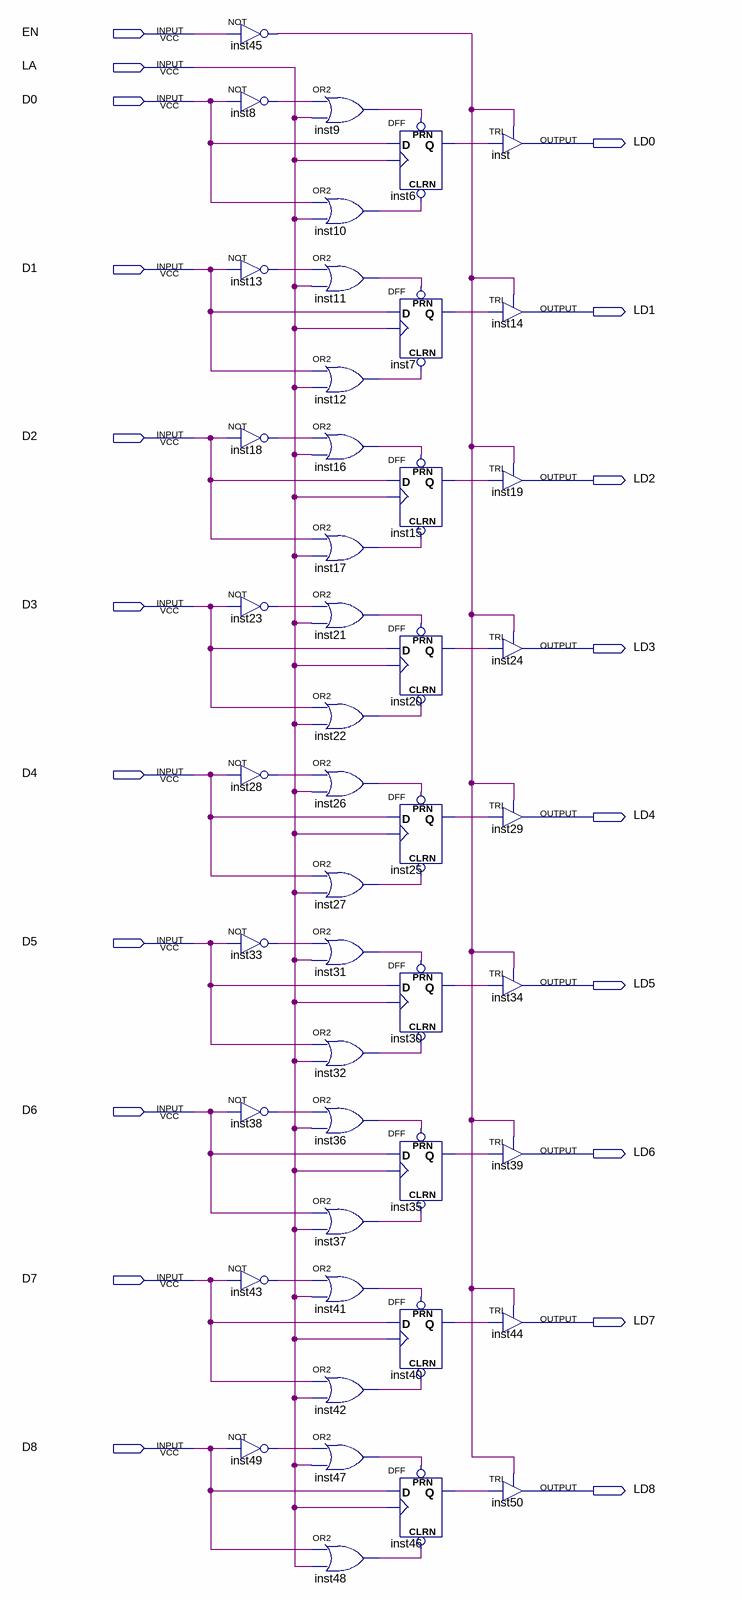
[diagram p0: schematic sheet]
// Quartus schematic 9latchhole.bdf as structural Verilog: 46 symbols, 20 pins
module \9latchhole  (
  input  EN,
  input  LA,
  input  D0,
  input  D1,
  input  D2,
  input  D3,
  input  D4,
  input  D5,
  input  D6,
  input  D7,
  input  D8,
  output LD0,
  output LD1,
  output LD2,
  output LD3,
  output LD4,
  output LD5,
  output LD6,
  output LD7,
  output LD8
);

  wire inst6_q, inst7_q, inst8_out, inst9_out, inst10_out, inst11_out, inst12_out, inst13_out, inst15_q,
       inst16_out, inst17_out, inst18_out, inst20_q, inst21_out, inst22_out, inst23_out, inst25_q,
       inst26_out, inst27_out, inst28_out, inst30_q, inst31_out, inst32_out, inst33_out, inst35_q,
       inst36_out, inst37_out, inst38_out, inst40_q, inst41_out, inst42_out, inst43_out, inst45_out,
       inst46_q, inst47_out, inst48_out, inst49_out;

  not inst45 (inst45_out, EN);
  not inst8 (inst8_out, D0);
  not inst13 (inst13_out, D1);
  not inst18 (inst18_out, D2);
  not inst23 (inst23_out, D3);
  not inst28 (inst28_out, D4);
  not inst33 (inst33_out, D5);
  not inst38 (inst38_out, D6);
  not inst43 (inst43_out, D7);
  not inst49 (inst49_out, D8);
  or inst9 (inst9_out, inst8_out, LA);
  or inst10 (inst10_out, D0, LA);
  or inst11 (inst11_out, inst13_out, LA);
  or inst12 (inst12_out, D1, LA);
  or inst16 (inst16_out, inst18_out, LA);
  or inst17 (inst17_out, D2, LA);
  or inst21 (inst21_out, inst23_out, LA);
  or inst22 (inst22_out, D3, LA);
  or inst26 (inst26_out, inst28_out, LA);
  or inst27 (inst27_out, D4, LA);
  or inst31 (inst31_out, inst33_out, LA);
  or inst32 (inst32_out, D5, LA);
  or inst36 (inst36_out, inst38_out, LA);
  or inst37 (inst37_out, D6, LA);
  or inst41 (inst41_out, inst43_out, LA);
  or inst42 (inst42_out, D7, LA);
  or inst47 (inst47_out, inst49_out, LA);
  or inst48 (inst48_out, D8, LA);
  DFF inst6 (.CLRN(inst10_out), .CLK(LA), .D(D0), .PRN(inst9_out), .Q(inst6_q));
  DFF inst7 (.CLRN(inst12_out), .CLK(LA), .D(D1), .PRN(inst11_out), .Q(inst7_q));
  DFF inst15 (.CLRN(inst17_out), .CLK(LA), .D(D2), .PRN(inst16_out), .Q(inst15_q));
  DFF inst20 (.CLRN(inst22_out), .CLK(LA), .D(D3), .PRN(inst21_out), .Q(inst20_q));
  DFF inst25 (.CLRN(inst27_out), .CLK(LA), .D(D4), .PRN(inst26_out), .Q(inst25_q));
  DFF inst30 (.CLRN(inst32_out), .CLK(LA), .D(D5), .PRN(inst31_out), .Q(inst30_q));
  DFF inst35 (.CLRN(inst37_out), .CLK(LA), .D(D6), .PRN(inst36_out), .Q(inst35_q));
  DFF inst40 (.CLRN(inst42_out), .CLK(LA), .D(D7), .PRN(inst41_out), .Q(inst40_q));
  DFF inst46 (.CLRN(inst48_out), .CLK(LA), .D(D8), .PRN(inst47_out), .Q(inst46_q));
  TRI inst (.IN(inst6_q), .OE(inst45_out), .OUT(LD0));
  TRI inst14 (.IN(inst7_q), .OE(inst45_out), .OUT(LD1));
  TRI inst19 (.IN(inst15_q), .OE(inst45_out), .OUT(LD2));
  TRI inst24 (.IN(inst20_q), .OE(inst45_out), .OUT(LD3));
  TRI inst29 (.IN(inst25_q), .OE(inst45_out), .OUT(LD4));
  TRI inst34 (.IN(inst30_q), .OE(inst45_out), .OUT(LD5));
  TRI inst39 (.IN(inst35_q), .OE(inst45_out), .OUT(LD6));
  TRI inst44 (.IN(inst40_q), .OE(inst45_out), .OUT(LD7));
  TRI inst50 (.IN(inst46_q), .OE(inst45_out), .OUT(LD8));
endmodule
